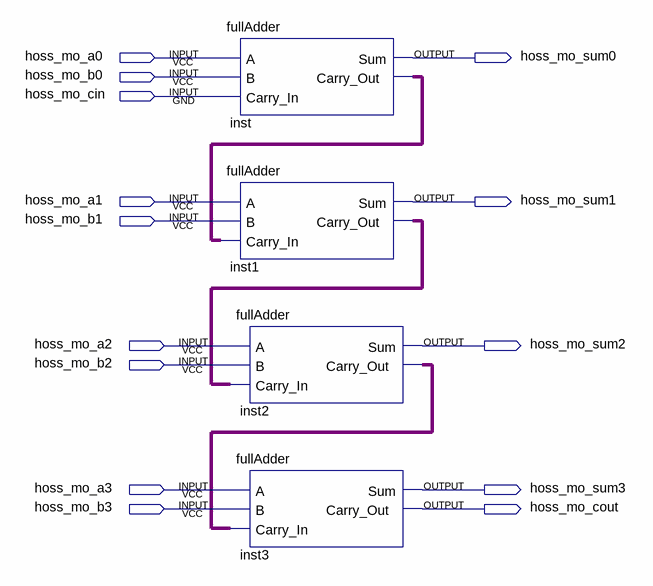
[diagram p0: schematic sheet]
// Quartus schematic fourbitAdder.bdf as structural Verilog: 4 symbols, 14 pins
module fourbitAdder (
  input  hoss_mo_a0,
  input  hoss_mo_b0,
  input  hoss_mo_cin,
  input  hoss_mo_a1,
  input  hoss_mo_b1,
  input  hoss_mo_a2,
  input  hoss_mo_b2,
  input  hoss_mo_a3,
  input  hoss_mo_b3,
  output hoss_mo_sum0,
  output hoss_mo_sum1,
  output hoss_mo_sum2,
  output hoss_mo_sum3,
  output hoss_mo_cout
);

  wire inst1_carry_out, inst2_carry_out, inst_carry_out;

  fullAdder inst (
    .A(hoss_mo_a0), .B(hoss_mo_b0), .Carry_In(hoss_mo_cin), .Sum(hoss_mo_sum0), .Carry_Out(inst_carry_out));
  fullAdder inst1 (
    .A(hoss_mo_a1), .B(hoss_mo_b1), .Carry_In(inst_carry_out), .Sum(hoss_mo_sum1), .Carry_Out(inst1_carry_out));
  fullAdder inst2 (
    .A(hoss_mo_a2), .B(hoss_mo_b2), .Carry_In(inst1_carry_out), .Sum(hoss_mo_sum2),
    .Carry_Out(inst2_carry_out));
  fullAdder inst3 (
    .A(hoss_mo_a3), .B(hoss_mo_b3), .Carry_In(inst2_carry_out), .Sum(hoss_mo_sum3), .Carry_Out(hoss_mo_cout));
endmodule
